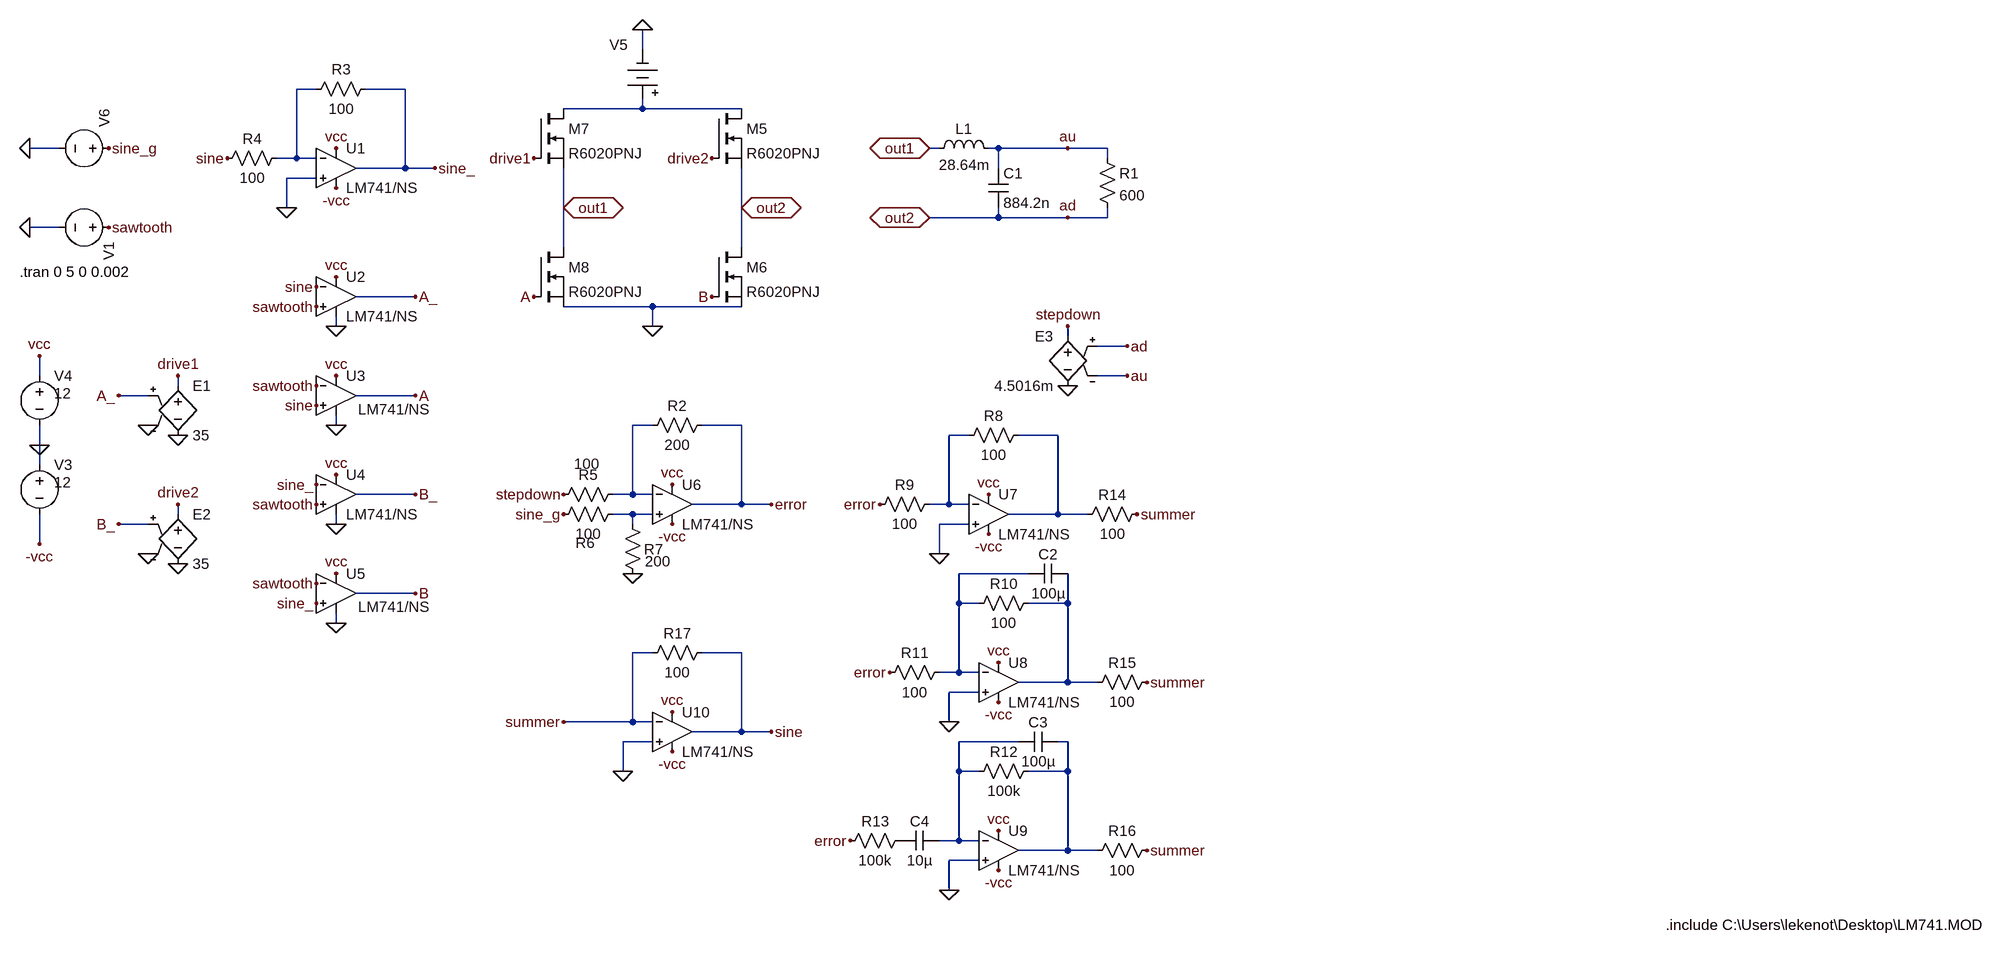
[diagram p0: schematic inverter.asc]
inverter.asc, the LTspice schematic file:
Version 4
SHEET 1 3020 1140
WIRE 800 -416 800 -448
WIRE 272 -352 240 -352
WIRE 416 -352 352 -352
WIRE 800 -320 800 -336
WIRE 800 -320 672 -320
WIRE 960 -320 800 -320
WIRE -144 -256 -192 -256
WIRE 1280 -256 1264 -256
WIRE 1376 -256 1360 -256
WIRE 1488 -256 1376 -256
WIRE 1552 -256 1488 -256
WIRE 240 -240 240 -352
WIRE 240 -240 208 -240
WIRE 272 -240 240 -240
WIRE 1552 -240 1552 -256
WIRE 416 -224 416 -352
WIRE 416 -224 336 -224
WIRE 464 -224 416 -224
WIRE 1376 -224 1376 -256
WIRE 272 -208 224 -208
WIRE 224 -160 224 -208
WIRE 672 -160 672 -224
WIRE 960 -160 960 -224
WIRE 1376 -144 1376 -160
WIRE 1376 -144 1264 -144
WIRE 1488 -144 1376 -144
WIRE 1552 -144 1552 -160
WIRE 1552 -144 1488 -144
WIRE -144 -128 -192 -128
WIRE 672 -96 672 -160
WIRE 960 -96 960 -160
WIRE 432 -16 336 -16
WIRE 816 0 672 0
WIRE 960 0 816 0
WIRE 304 32 304 16
WIRE 816 32 816 0
WIRE 1488 48 1488 32
WIRE 1584 64 1536 64
WIRE -176 112 -176 80
WIRE 1584 112 1536 112
WIRE 48 128 48 112
WIRE 0 144 -48 144
WIRE 432 144 336 144
WIRE 304 192 304 176
WIRE 816 192 784 192
WIRE 960 192 896 192
WIRE 1328 208 1296 208
WIRE 1472 208 1408 208
WIRE -176 224 -176 192
WIRE -176 256 -176 224
WIRE 432 304 336 304
WIRE 784 304 784 192
WIRE 784 304 752 304
WIRE 816 304 784 304
WIRE 960 320 960 192
WIRE 960 320 880 320
WIRE 1008 320 960 320
WIRE 1296 320 1296 208
WIRE 1296 320 1264 320
WIRE 1328 320 1296 320
WIRE 48 336 48 320
WIRE 784 336 752 336
WIRE 816 336 784 336
WIRE 1472 336 1472 208
WIRE 1472 336 1392 336
WIRE 1520 336 1472 336
WIRE 0 352 -48 352
WIRE 304 352 304 336
WIRE 784 352 784 336
WIRE 1328 352 1280 352
WIRE -176 384 -176 336
WIRE 1280 400 1280 352
WIRE 1424 432 1312 432
WIRE 432 464 336 464
WIRE 1312 480 1312 432
WIRE 1344 480 1312 480
WIRE 1488 480 1488 432
WIRE 1488 480 1424 480
WIRE 304 512 304 496
WIRE 816 560 784 560
WIRE 960 560 896 560
WIRE 1312 592 1312 480
WIRE 1312 592 1280 592
WIRE 1344 592 1312 592
WIRE 1488 608 1488 480
WIRE 1488 608 1408 608
WIRE 1536 608 1488 608
WIRE 1344 624 1296 624
WIRE 784 672 784 560
WIRE 784 672 672 672
WIRE 816 672 784 672
WIRE 1296 672 1296 624
WIRE 960 688 960 560
WIRE 960 688 880 688
WIRE 1008 688 960 688
WIRE 816 704 768 704
WIRE 1408 704 1312 704
WIRE 1488 704 1472 704
WIRE 768 752 768 704
WIRE 1312 752 1312 704
WIRE 1344 752 1312 752
WIRE 1488 752 1488 704
WIRE 1488 752 1424 752
WIRE 1312 864 1312 752
WIRE 1312 864 1280 864
WIRE 1344 864 1312 864
WIRE 1488 880 1488 752
WIRE 1488 880 1408 880
WIRE 1536 880 1488 880
WIRE 1344 896 1296 896
WIRE 1296 944 1296 896
FLAG -192 -128 0
FLAG -176 224 0
FLAG -176 80 vcc
FLAG -176 384 -vcc
FLAG -48 144 A_
FLAG -48 352 B_
FLAG 0 192 0
FLAG 0 400 0
FLAG 48 416 0
FLAG 48 208 0
FLAG 48 112 drive1
FLAG 48 320 drive2
FLAG -64 -128 sawtooth
FLAG -192 -256 0
FLAG -64 -256 sine_g
FLAG 304 -256 vcc
FLAG 304 -192 -vcc
FLAG 224 -160 0
FLAG 128 -240 sine
FLAG 464 -224 sine_
FLAG 304 -48 vcc
FLAG 816 32 0
FLAG 800 -448 0
FLAG 432 144 A
FLAG 432 -16 A_
FLAG 624 -240 drive1
FLAG 912 -16 B
FLAG 624 -16 A
FLAG 912 -240 drive2
FLAG 304 112 vcc
FLAG 272 -32 sine
FLAG 272 160 sine
FLAG 272 128 sawtooth
FLAG 272 0 sawtooth
FLAG 304 272 vcc
FLAG 432 464 B
FLAG 432 304 B_
FLAG 304 432 vcc
FLAG 272 288 sine_
FLAG 272 480 sine_
FLAG 272 448 sawtooth
FLAG 272 320 sawtooth
FLAG 672 -160 out1
IOPIN 672 -160 BiDir
FLAG 960 -160 out2
IOPIN 960 -160 BiDir
FLAG 304 32 0
FLAG 304 192 0
FLAG 304 352 0
FLAG 304 512 0
FLAG 1488 128 0
FLAG 1488 32 stepdown
FLAG 1264 -144 out2
IOPIN 1264 -144 BiDir
FLAG 1264 -256 out1
IOPIN 1264 -256 BiDir
FLAG 1584 64 ad
FLAG 1488 -256 au
FLAG 1488 -144 ad
FLAG 1584 112 au
FLAG 848 288 vcc
FLAG 848 352 -vcc
FLAG 672 304 stepdown
FLAG 1008 320 error
FLAG 672 336 sine_g
FLAG 784 432 0
FLAG 1360 304 vcc
FLAG 1360 368 -vcc
FLAG 1280 400 0
FLAG 1184 320 error
FLAG 1600 336 summer
FLAG 1376 576 vcc
FLAG 1376 640 -vcc
FLAG 1296 672 0
FLAG 1200 592 error
FLAG 1616 608 summer
FLAG 848 656 vcc
FLAG 848 720 -vcc
FLAG 768 752 0
FLAG 672 672 summer
FLAG 1008 688 sine
FLAG 1376 848 vcc
FLAG 1376 912 -vcc
FLAG 1296 944 0
FLAG 1136 864 error
FLAG 1616 880 summer
SYMBOL voltage -48 -128 R90
WINDOW 3 24 96 Invisible 2
WINDOW 123 0 0 Left 0
WINDOW 39 0 0 Left 0
SYMATTR Value PULSE(-2 2 0 0.000025 0.000025 0 0.0000500005)
SYMATTR InstName V1
SYMBOL voltage -176 240 R0
WINDOW 3 24 44 Left 2
WINDOW 123 0 0 Left 0
WINDOW 39 0 0 Left 0
SYMATTR Value 12
SYMATTR InstName V3
SYMBOL voltage -176 96 R0
WINDOW 3 24 44 Left 2
WINDOW 123 0 0 Left 0
WINDOW 39 0 0 Left 0
SYMATTR Value 12
SYMATTR InstName V4
SYMBOL e 48 112 R0
SYMATTR InstName E1
SYMATTR Value 35
SYMBOL e 48 320 R0
SYMATTR InstName E2
SYMATTR Value 35
SYMBOL voltage -48 -256 R90
WINDOW 0 -63 23 Left 2
WINDOW 3 24 96 Invisible 2
WINDOW 123 0 0 Left 0
WINDOW 39 0 0 Left 0
SYMATTR InstName V6
SYMATTR Value SINE(0 2 50 0 0 180)
SYMBOL Opamps\\opamp2 304 -288 R0
SYMATTR InstName U1
SYMATTR Value LM741/NS
SYMBOL res 368 -368 R90
WINDOW 0 0 56 VBottom 2
WINDOW 3 32 56 VTop 2
SYMATTR InstName R3
SYMATTR Value 100
SYMBOL res 224 -256 R90
WINDOW 0 0 56 VBottom 2
WINDOW 3 32 56 VTop 2
SYMATTR InstName R4
SYMATTR Value 100
SYMBOL Opamps\\opamp2 304 -80 R0
SYMATTR InstName U2
SYMATTR Value LM741/NS
SYMBOL Opamps\\opamp2 304 80 R0
WINDOW 3 36 86 Left 2
SYMATTR Value LM741/NS
SYMATTR InstName U3
SYMBOL nmos 912 -320 R0
SYMATTR InstName M5
SYMATTR Value R6020PNJ
SYMBOL nmos 912 -96 R0
SYMATTR InstName M6
SYMATTR Value R6020PNJ
SYMBOL nmos 624 -320 R0
SYMATTR InstName M7
SYMATTR Value R6020PNJ
SYMBOL nmos 624 -96 R0
SYMATTR InstName M8
SYMATTR Value R6020PNJ
SYMBOL Misc\\battery 800 -320 R180
WINDOW 0 24 104 Left 2
WINDOW 3 24 16 Invisible 2
WINDOW 123 0 0 Left 0
WINDOW 39 0 0 Left 0
SYMATTR InstName V5
SYMATTR Value 400
SYMBOL Opamps\\opamp2 304 240 R0
SYMATTR InstName U4
SYMATTR Value LM741/NS
SYMBOL Opamps\\opamp2 304 400 R0
WINDOW 3 36 86 Left 2
SYMATTR Value LM741/NS
SYMATTR InstName U5
SYMBOL e 1488 32 M0
SYMATTR InstName E3
SYMATTR Value 4.5016m
SYMBOL ind 1264 -240 R270
WINDOW 0 32 56 VTop 2
WINDOW 3 5 56 VBottom 2
SYMATTR InstName L1
SYMATTR Value 28.64m
SYMATTR SpiceLine Ipk=4
SYMBOL cap 1360 -224 R0
SYMATTR InstName C1
SYMATTR Value 884.2n
SYMBOL res 1536 -256 R0
SYMATTR InstName R1
SYMATTR Value 600
SYMBOL Opamps\\opamp2 848 256 R0
SYMATTR InstName U6
SYMATTR Value LM741/NS
SYMBOL res 912 176 R90
WINDOW 0 0 56 VBottom 2
WINDOW 3 32 56 VTop 2
SYMATTR InstName R2
SYMATTR Value 200
SYMBOL res 768 288 R90
WINDOW 0 0 56 VBottom 2
WINDOW 3 -49 59 VTop 2
SYMATTR InstName R5
SYMATTR Value 100
SYMBOL res 768 320 R90
WINDOW 0 78 61 VBottom 2
WINDOW 3 32 56 VTop 2
SYMATTR InstName R6
SYMATTR Value 100
SYMBOL res 768 336 R0
WINDOW 0 34 57 Left 2
SYMATTR InstName R7
SYMATTR Value 200
SYMBOL Opamps\\opamp2 1360 272 R0
SYMATTR InstName U7
SYMATTR Value LM741/NS
SYMBOL res 1424 192 R90
WINDOW 0 0 56 VBottom 2
WINDOW 3 32 56 VTop 2
SYMATTR InstName R8
SYMATTR Value 100
SYMBOL res 1280 304 R90
WINDOW 0 0 56 VBottom 2
WINDOW 3 32 56 VTop 2
SYMATTR InstName R9
SYMATTR Value 100
SYMBOL Opamps\\opamp2 1376 544 R0
SYMATTR InstName U8
SYMATTR Value LM741/NS
SYMBOL res 1440 464 R90
WINDOW 0 0 56 VBottom 2
WINDOW 3 32 56 VTop 2
SYMATTR InstName R10
SYMATTR Value 100
SYMBOL res 1296 576 R90
WINDOW 0 0 56 VBottom 2
WINDOW 3 32 56 VTop 2
SYMATTR InstName R11
SYMATTR Value 100
SYMBOL cap 1424 448 R270
WINDOW 0 32 32 VTop 2
WINDOW 3 0 32 VBottom 2
SYMATTR InstName C2
SYMATTR Value 100µ
SYMBOL res 1616 320 R90
WINDOW 0 0 56 VBottom 2
WINDOW 3 32 56 VTop 2
SYMATTR InstName R14
SYMATTR Value 100
SYMBOL res 1632 592 R90
WINDOW 0 0 56 VBottom 2
WINDOW 3 32 56 VTop 2
SYMATTR InstName R15
SYMATTR Value 100
SYMBOL Opamps\\opamp2 848 624 R0
SYMATTR InstName U10
SYMATTR Value LM741/NS
SYMBOL res 912 544 R90
WINDOW 0 0 56 VBottom 2
WINDOW 3 32 56 VTop 2
SYMATTR InstName R17
SYMATTR Value 100
SYMBOL Opamps\\opamp2 1376 816 R0
SYMATTR InstName U9
SYMATTR Value LM741/NS
SYMBOL res 1440 736 R90
WINDOW 0 0 56 VBottom 2
WINDOW 3 32 56 VTop 2
SYMATTR InstName R12
SYMATTR Value 100k
SYMBOL res 1232 848 R90
WINDOW 0 0 56 VBottom 2
WINDOW 3 32 56 VTop 2
SYMATTR InstName R13
SYMATTR Value 100k
SYMBOL res 1632 864 R90
WINDOW 0 0 56 VBottom 2
WINDOW 3 32 56 VTop 2
SYMATTR InstName R16
SYMATTR Value 100
SYMBOL cap 1472 688 R90
WINDOW 0 0 32 VBottom 2
WINDOW 3 32 32 VTop 2
SYMATTR InstName C3
SYMATTR Value 100µ
SYMBOL cap 1280 848 R90
WINDOW 0 0 32 VBottom 2
WINDOW 3 32 32 VTop 2
SYMATTR InstName C4
SYMATTR Value 10µ
TEXT -208 -56 Left 2 !.tran 0 5 0 0.002
TEXT 2456 1000 Left 2 !.include C:\\Users\\lekenot\\Desktop\\LM741.MOD

The netlist it stands for:
* inverter.asc
V1 sawtooth 0 PULSE(-2 2 0 0.000025 0.000025 0 0.0000500005)
V3 0 -vcc 12
V4 vcc 0 12
E1 drive1 0 A_ 0 35
E2 drive2 0 B_ 0 35
V6 sine_g 0 SINE(0 2 50 0 0 180)
XU1 0 N001 vcc -vcc sine_ LM741/NS  ; pins In+ In- V+ V- OUT
R3 sine_ N001 100
R4 N001 sine 100
XU2 sawtooth sine vcc 0 A_ LM741/NS  ; pins In+ In- V+ V- OUT
XU3 sine sawtooth vcc 0 A LM741/NS  ; pins In+ In- V+ V- OUT
M5 N002 drive2 ad ad R6020PNJ
M6 ad B 0 0 R6020PNJ
M7 N002 drive1 out1 out1 R6020PNJ
M8 out1 A 0 0 R6020PNJ
V5 N002 0 400
XU4 sawtooth sine_ vcc 0 B_ LM741/NS  ; pins In+ In- V+ V- OUT
XU5 sine_ sawtooth vcc 0 B LM741/NS  ; pins In+ In- V+ V- OUT
E3 stepdown 0 ad au 4.5016m
L1 out1 au 28.64m Ipk=4
C1 au ad 884.2n
R1 au ad 600
XU6 N006 N003 vcc -vcc error LM741/NS  ; pins In+ In- V+ V- OUT
R2 error N003 200
R5 N003 stepdown 100
R6 N006 sine_g 100
R7 N006 0 200
XU7 0 N004 vcc -vcc N005 LM741/NS  ; pins In+ In- V+ V- OUT
R8 N005 N004 100
R9 N004 error 100
XU8 0 N007 vcc -vcc N008 LM741/NS  ; pins In+ In- V+ V- OUT
R10 N008 N007 100
R11 N007 error 100
C2 N007 N008 100µ
R14 summer N005 100
R15 summer N008 100
XU10 0 summer vcc -vcc sine LM741/NS  ; pins In+ In- V+ V- OUT
R17 sine summer 100
XU9 0 N009 vcc -vcc N010 LM741/NS  ; pins In+ In- V+ V- OUT
R12 N010 N009 100k
R13 P001 error 100k
R16 summer N010 100
C3 N010 N009 100µ
C4 N009 P001 10µ
.model NMOS NMOS
.model PMOS PMOS
.lib standard.mos
.tran 0 5 0 0.002
.include C:\Users\lekenot\Desktop\LM741.MOD
.backanno
.end